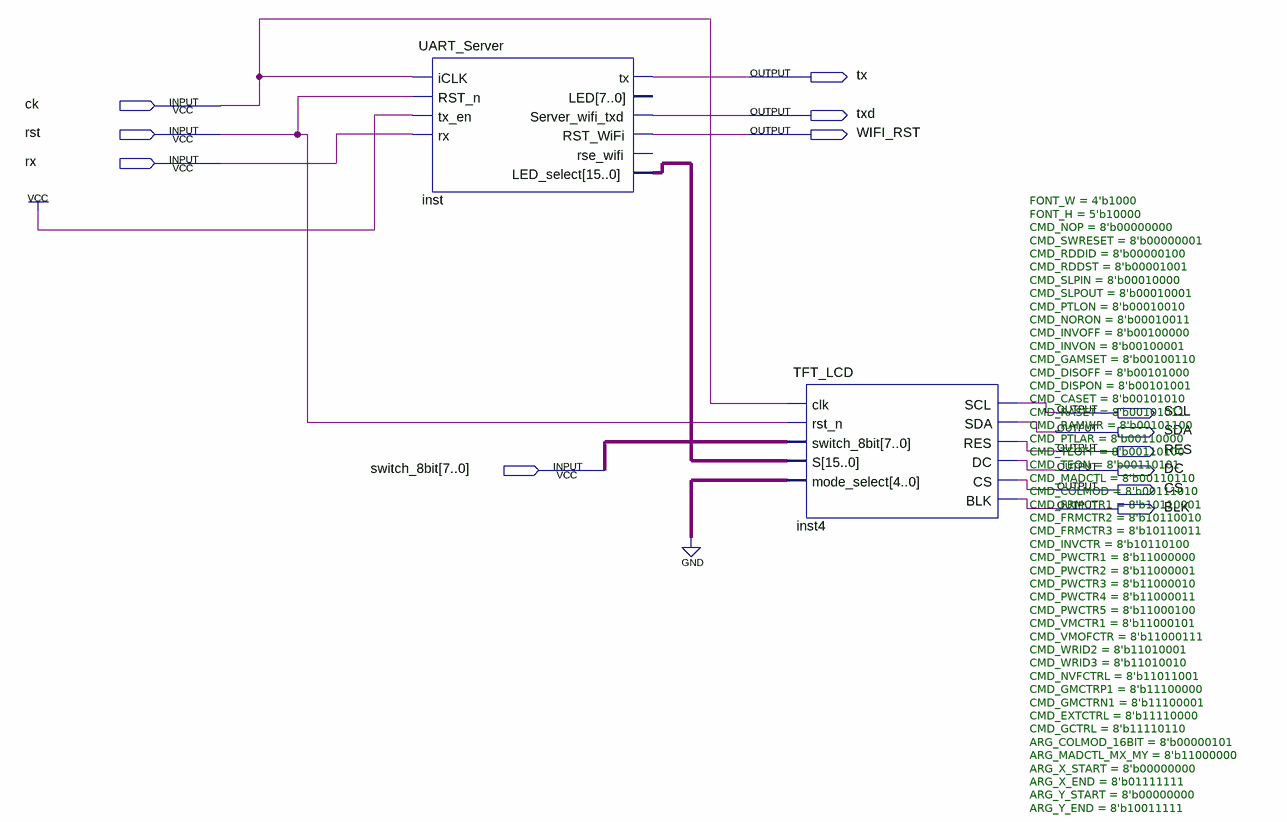
[diagram p0: schematic sheet]
// Quartus schematic top.bdf as structural Verilog: 2 symbols, 13 pins
module top (
  input  ck,
  input  rst,
  input  rx,
  input  [7:0] switch_8bit,
  output tx,
  output txd,
  output WIFI_RST,
  output SCL,
  output SDA,
  output RES,
  output DC,
  output CS,
  output BLK
);

  wire [15:0] inst_led_select;

  UART_Server inst (
    .iCLK(ck), .RST_n(rst), .tx_en(1'b1), .rx(rx), .tx(tx), .Server_wifi_txd(txd), .RST_WiFi(WIFI_RST),
    .LED_select(inst_led_select));  // open: LED, rse_wifi
  TFT_LCD #(.FONT_W(4'b1000), .FONT_H(5'b10000), .CMD_NOP(8'b00000000), .CMD_SWRESET(8'b00000001), .CMD_RDDID(8'b00000100), .CMD_RDDST(8'b00001001), .CMD_SLPIN(8'b00010000), .CMD_SLPOUT(8'b00010001), .CMD_PTLON(8'b00010010), .CMD_NORON(8'b00010011), .CMD_INVOFF(8'b00100000), .CMD_INVON(8'b00100001), .CMD_GAMSET(8'b00100110), .CMD_DISOFF(8'b00101000), .CMD_DISPON(8'b00101001), .CMD_CASET(8'b00101010), .CMD_RASET(8'b00101011), .CMD_RAMWR(8'b00101100), .CMD_PTLAR(8'b00110000), .CMD_TEOFF(8'b00110100), .CMD_TEON(8'b00110101), .CMD_MADCTL(8'b00110110), .CMD_COLMOD(8'b00111010), .CMD_FRMCTR1(8'b10110001), .CMD_FRMCTR2(8'b10110010), .CMD_FRMCTR3(8'b10110011), .CMD_INVCTR(8'b10110100), .CMD_PWCTR1(8'b11000000), .CMD_PWCTR2(8'b11000001), .CMD_PWCTR3(8'b11000010), .CMD_PWCTR4(8'b11000011), .CMD_PWCTR5(8'b11000100), .CMD_VMCTR1(8'b11000101), .CMD_VMOFCTR(8'b11000111), .CMD_WRID2(8'b11010001), .CMD_WRID3(8'b11010010), .CMD_NVFCTRL(8'b11011001), .CMD_GMCTRP1(8'b11100000), .CMD_GMCTRN1(8'b11100001), .CMD_EXTCTRL(8'b11110000), .CMD_GCTRL(8'b11110110), .ARG_COLMOD_16BIT(8'b00000101), .ARG_MADCTL_MX_MY(8'b11000000), .ARG_X_START(8'b00000000), .ARG_X_END(8'b01111111), .ARG_Y_START(8'b00000000), .ARG_Y_END(8'b10011111)) inst4 (
    .clk(ck), .rst_n(rst), .switch_8bit(switch_8bit), .S(inst_led_select), .mode_select({5{1'b0}}),
    .SCL(SCL), .SDA(SDA), .RES(RES), .DC(DC), .CS(CS), .BLK(BLK));
endmodule
